# Altium schematic sheet vfd_pt6315.SchDoc
size A3
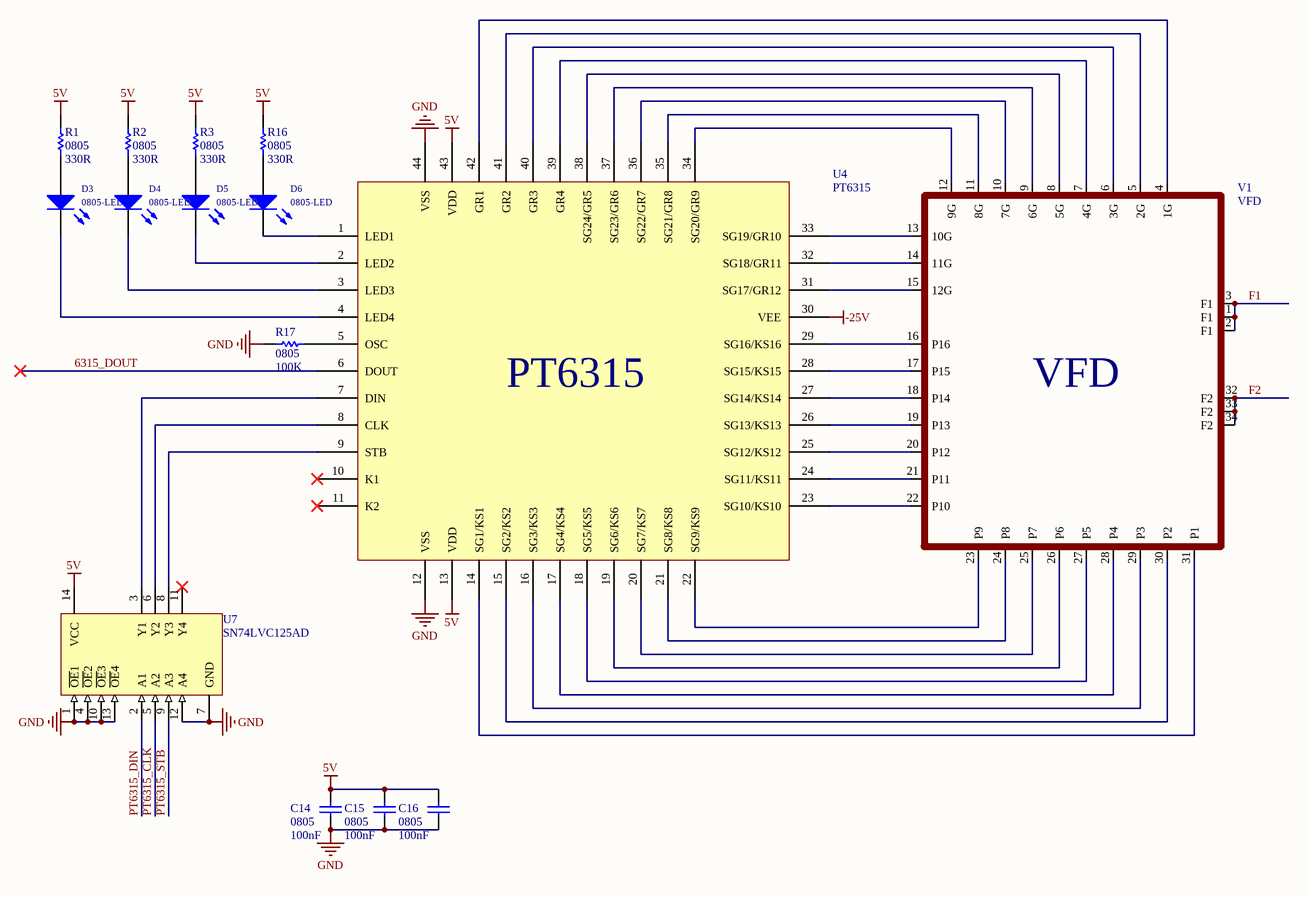
[diagram p0: vfd_pt6315.SchDoc]

## Parts
C14  0805  value 100nF  [6-0805_N]
C15  0805  value 100nF  [6-0805_N]
C16  0805  value 100nF  [6-0805_N]
D3  0805-LED  [SMD _LED]
D4  0805-LED  [SMD _LED]
D5  0805-LED  [SMD _LED]
D6  0805-LED  [SMD _LED]
R1  0805  value 330R  [6-0805_N]
R2  0805  value 330R  [6-0805_N]
R3  0805  value 330R  [6-0805_N]
R16  0805  value 330R  [6-0805_N]
R17  0805  value 100K  [6-0805_N]
U4  PT6315  [LQFP44_10X10X08P]
U7  SN74LVC125AD  [D014_N]
V1  VFD  [VFD48-1202FN]

## Nets
5V: C14.2 C15.2 C16.2 R1.2 R2.2 R3.2 R16.2 U4.13(VDD) U4.43(VDD) U7.14(VCC)
-25V: U4.30(VEE)
GND: C14.1 C15.1 C16.1 R17.1 U4.12(VSS) U4.44(VSS) U7.1(~{OE}1) U7.4(~{OE}2) U7.7(GND) U7.10(~{OE}3) U7.12(A4) U7.13(~{OE}4)
6315_DOUT: U4.6(DOUT)
F1: V1.1(F1) V1.2(F1) V1.3(F1)
F2: V1.32(F2) V1.33(F2) V1.34(F2)
PT6315_CLK: U7.5(A2)
PT6315_DIN: U7.2(A1)
PT6315_STB: U7.9(A3)
NetD3_1: D3.1(A) R1.1
NetD3_2: D3.2(K) U4.4(LED4)
NetD4_1: D4.1(A) R2.1
NetD4_2: D4.2(K) U4.3(LED3)
NetD5_1: D5.1(A) R3.1
NetD5_2: D5.2(K) U4.2(LED2)
NetD6_1: D6.1(A) R16.1
NetD6_2: D6.2(K) U4.1(LED1)
NetR17_2: R17.2 U4.5(OSC)
NetU4_7: U4.7(DIN) U7.3(Y1)
NetU4_8: U4.8(CLK) U7.6(Y2)
NetU4_9: U4.9(STB) U7.8(Y3)
NetU4_14: U4.14(SG1/KS1) V1.31(P1)
NetU4_15: U4.15(SG2/KS2) V1.30(P2)
NetU4_16: U4.16(SG3/KS3) V1.29(P3)
NetU4_17: U4.17(SG4/KS4) V1.28(P4)
NetU4_18: U4.18(SG5/KS5) V1.27(P5)
NetU4_19: U4.19(SG6/KS6) V1.26(P6)
NetU4_20: U4.20(SG7/KS7) V1.25(P7)
NetU4_21: U4.21(SG8/KS8) V1.24(P8)
NetU4_22: U4.22(SG9/KS9) V1.23(P9)
NetU4_23: U4.23(SG10/KS10) V1.22(P10)
NetU4_24: U4.24(SG11/KS11) V1.21(P11)
NetU4_25: U4.25(SG12/KS12) V1.20(P12)
NetU4_26: U4.26(SG13/KS13) V1.19(P13)
NetU4_27: U4.27(SG14/KS14) V1.18(P14)
NetU4_28: U4.28(SG15/KS15) V1.17(P15)
NetU4_29: U4.29(SG16/KS16) V1.16(P16)
NetU4_31: U4.31(SG17/GR12) V1.15(12G)
NetU4_32: U4.32(SG18/GR11) V1.14(11G)
NetU4_33: U4.33(SG19/GR10) V1.13(10G)
NetU4_34: U4.34(SG20/GR9) V1.12(9G)
NetU4_35: U4.35(SG21/GR8) V1.11(8G)
NetU4_36: U4.36(SG22/GR7) V1.10(7G)
NetU4_37: U4.37(SG23/GR6) V1.9(6G)
NetU4_38: U4.38(SG24/GR5) V1.8(5G)
NetU4_39: U4.39(GR4) V1.7(4G)
NetU4_40: U4.40(GR3) V1.6(3G)
NetU4_41: U4.41(GR2) V1.5(2G)
NetU4_42: U4.42(GR1) V1.4(1G)

Not connected (* = marked no-connect by the designer): U4 10(K1)* 11(K2)*; U7 11(Y4)*

## Library data of the parts
C14-C16 = CAP: Capacitor; Published: 8-Jun-2000; Revision: July-2002: Re-released for DXP Platform.; Publisher: Altium Limited
D3-D6 = HSMX-C670_1: Typical RED GaAs SMD LED Agilent make; AEMS Code: 2610081; Revision: July-2002: Re-released for DXP Platform.
R1-R3 R16 R17 = Res1: Resistor; Published: 8-Jun-2000; LatestRevisionDate: 17-Jul-2002; LatestRevisionNote: Re-released for DXP Platform.; PackageReference: AXIAL-0.3; Publisher: Altium Limited
U7 = SN74LVC125AD: Quadruple Bus Buffer Gate with 3-State Outputs; Published: 8-Jun-2000; LatestRevisionDate: 13-Apr-2006; LatestRevisionNote: IPC-7351 Footprint Added.; DatasheetVersion: Jun-1998; PackageVersion: Jan-1998; PackageReference: D014; Publisher: Altium Limited; PackageDescription: 14-Pin Small Outline Integrated Circuit 1.27 mm Pitch; Code_IPC: SOIC127P600-14; ComponentLink1Description: Manufacturer Link; ComponentLink1URL: http://www.ti.com/; ComponentLink2Description: Datasheet; ComponentLink2URL: http://www-s.ti.com/sc/ds/sn74lvc125a.pdf
V1 = VFD48-1202FN